# EAGLE design mattduino_leonardo (EAGLE 8.6.3)

## Sheet 1 of 3
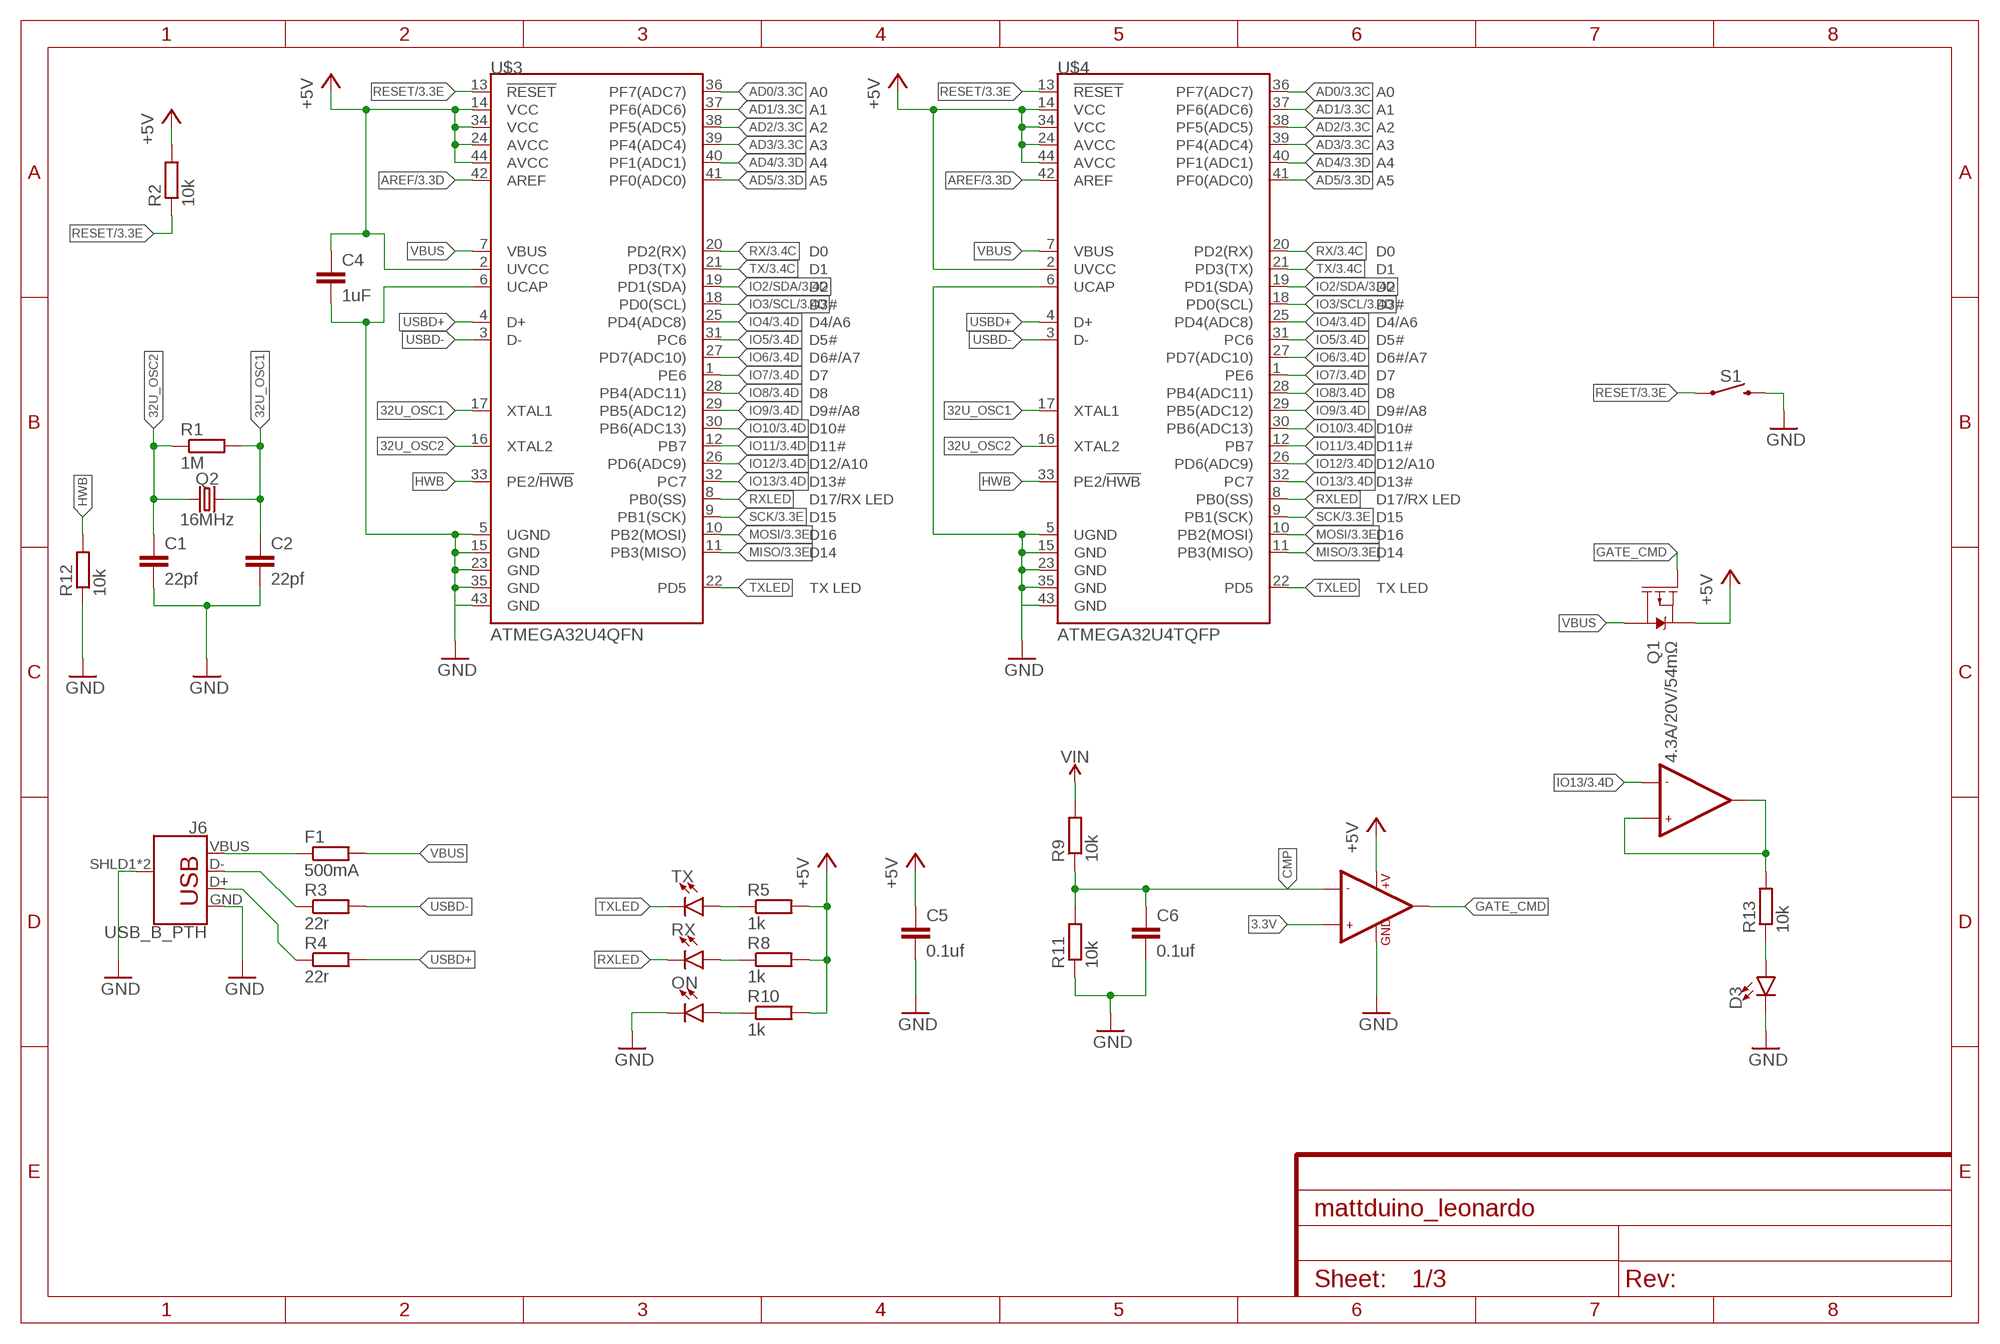
[diagram p0: schematic, sheet 1]

### Parts
C1  22pf  C-EUC1206  [C1206]
C2  22pf  C-EUC1206  [C1206]
C4  1uF  C-EUC1206  [C1206]
C5  0.1uf  C-EUC1206  [C1206]
C6  0.1uf  C-EUC1206  [C1206]
D3  LED1206  [LED-1206]
F1  500mA  R-EU_R1206  [R1206]
J6  USB_B_PTH  [USB-B-PTH]
ON  LED1206  [LED-1206]
Q1  4.3A/20V/54mΩ  MOSFET_PCH-IRLML2244  [SOT23-3]
Q2  16MHz  CRYSTALSMD-HC49UP  [HC49UP]
R1  1M  R-EU_R1206  [R1206]
R2  10k  R-EU_R1206  [R1206]
R3  22r  R-EU_R1206  [R1206]
R4  22r  R-EU_R1206  [R1206]
R5  1k  R-EU_R1206  [R1206]
R8  1k  R-EU_R1206  [R1206]
R9  10k  R-EU_R1206  [R1206]
R10  1k  R-EU_R1206  [R1206]
R11  10k  R-EU_R1206  [R1206]
R12  10k  R-EU_R1206  [R1206]
R13  10k  R-EU_R1206  [R1206]
RX  LED1206  [LED-1206]
S1  MOMENTARY-SWITCH-SPST-PTH-6.0MM-KIT  [TACTILE_SWITCH_PTH_6.0MM_KIT]
TX  LED1206  [LED-1206]
U$1  LMV358  [SO08]
U$3  ATMEGA32U4QFN  [SPARKFUN-DIGITALIC_QFN-44]
U$4  ATMEGA32U4TQFP  [SPARKFUN-DIGITALIC_TQFP44]

### Nets
3.3V: U$1.3(+IN1) ; also sheet 2,3
32U_OSC1: C2.1 Q2.2 R1.2 U$3.17(XTAL1) U$4.17(XTAL1)
32U_OSC2: C1.1 Q2.1 R1.1 U$3.16(XTAL2) U$4.16(XTAL2)
+5V [power usb]: C4.1 C5.1 Q1.2(S) R2.2 R5.2 R8.2 R10.2 U$1.8(+V) U$3.2(UVCC) U$3.14(VCC) U$3.24(AVCC) U$3.34(VCC) U$3.44(AVCC) U$4.2(UVCC) U$4.14(VCC) U$4.24(AVCC) U$4.34(VCC) U$4.44(AVCC) ; also sheet 2,3
AD0: U$3.36(PF7(ADC7)) U$4.36(PF7(ADC7)) ; also sheet 3
AD1: U$3.37(PF6(ADC6)) U$4.37(PF6(ADC6)) ; also sheet 3
AD2: U$3.38(PF5(ADC5)) U$4.38(PF5(ADC5)) ; also sheet 3
AD3: U$3.39(PF4(ADC4)) U$4.39(PF4(ADC4)) ; also sheet 3
AD4: U$3.40(PF1(ADC1)) U$4.40(PF1(ADC1)) ; also sheet 3
AD5: U$3.41(PF0(ADC0)) U$4.41(PF0(ADC0)) ; also sheet 3
AREF: U$3.42(AREF) U$4.42(AREF) ; also sheet 3
CMP: C6.1 R9.1 R11.2 U$1.2(-IN1)
GATE_CMD: Q1.1(G) U$1.1(OUT1)
GND [gnd]: C1.2 C2.2 C4.2 C5.2 C6.2 D3.C J6.GND J6.SHLD1(SHIELD) J6.SHLD2(SHIELD) ON.C R11.1 R12.1 S1.3 U$1.4(GND) U$3.5(UGND) U$3.6(UCAP) U$3.15(GND) U$3.23(GND) U$3.35(GND) U$3.43(GND) U$4.5(UGND) U$4.6(UCAP) U$4.15(GND) U$4.23(GND) U$4.35(GND) U$4.43(GND) ; also sheet 2,3
HWB: R12.2 U$3.33(PE2/!HWB) U$4.33(PE2/!HWB)
IO2/SDA: U$3.19(PD1(SDA)) U$4.19(PD1(SDA)) ; also sheet 3
IO3/SCL: U$3.18(PD0(SCL)) U$4.18(PD0(SCL)) ; also sheet 3
IO4: U$3.25(PD4(ADC8)) U$4.25(PD4(ADC8)) ; also sheet 3
IO5: U$3.31(PC6) U$4.31(PC6) ; also sheet 3
IO6: U$3.27(PD7(ADC10)) U$4.27(PD7(ADC10)) ; also sheet 3
IO7: U$3.1(PE6) U$4.1(PE6) ; also sheet 3
IO8: U$3.28(PB4(ADC11)) U$4.28(PB4(ADC11)) ; also sheet 3
IO9: U$3.29(PB5(ADC12)) U$4.29(PB5(ADC12)) ; also sheet 3
IO10: U$3.30(PB6(ADC13)) U$4.30(PB6(ADC13)) ; also sheet 3
IO11: U$3.12(PB7) U$4.12(PB7) ; also sheet 3
IO12: U$3.26(PD6(ADC9)) U$4.26(PD6(ADC9)) ; also sheet 3
IO13: U$1.6(-IN2) U$3.32(PC7) U$4.32(PC7) ; also sheet 3
MISO: U$3.11(PB3(MISO)) U$4.11(PB3(MISO)) ; also sheet 3
MOSI: U$3.10(PB2(MOSI)) U$4.10(PB2(MOSI)) ; also sheet 3
N$3: R13.2 U$1.5(+IN2) U$1.7(OUT2)
N$4: ON.A R10.1
N$5: D3.A R13.1
N$6: R8.1 RX.A
N$7: R5.1 TX.A
RESET: R2.1 S1.1 U$3.13(!RESET) U$4.13(!RESET) ; also sheet 3
RX: U$3.20(PD2(RX)) U$4.20(PD2(RX)) ; also sheet 3
RXLED: RX.C U$3.8(PB0(SS)) U$4.8(PB0(SS))
SCK: U$3.9(PB1(SCK)) U$4.9(PB1(SCK)) ; also sheet 3
TX: U$3.21(PD3(TX)) U$4.21(PD3(TX)) ; also sheet 3
TXLED: TX.C U$3.22(PD5) U$4.22(PD5)
USBD+: R4.2 U$3.4(D+) U$4.4(D+)
USBD-: R3.2 U$3.3(D-) U$4.3(D-)
USBR+: J6.D+ R4.1
USBR-: J6.D- R3.1
VBUS: F1.2 Q1.3(D) U$3.7(VBUS) U$4.7(VBUS)
VBUS_UNFUSED: F1.1 J6.VBUS
VIN: R9.2 ; also sheet 2,3

## Sheet 2 of 3
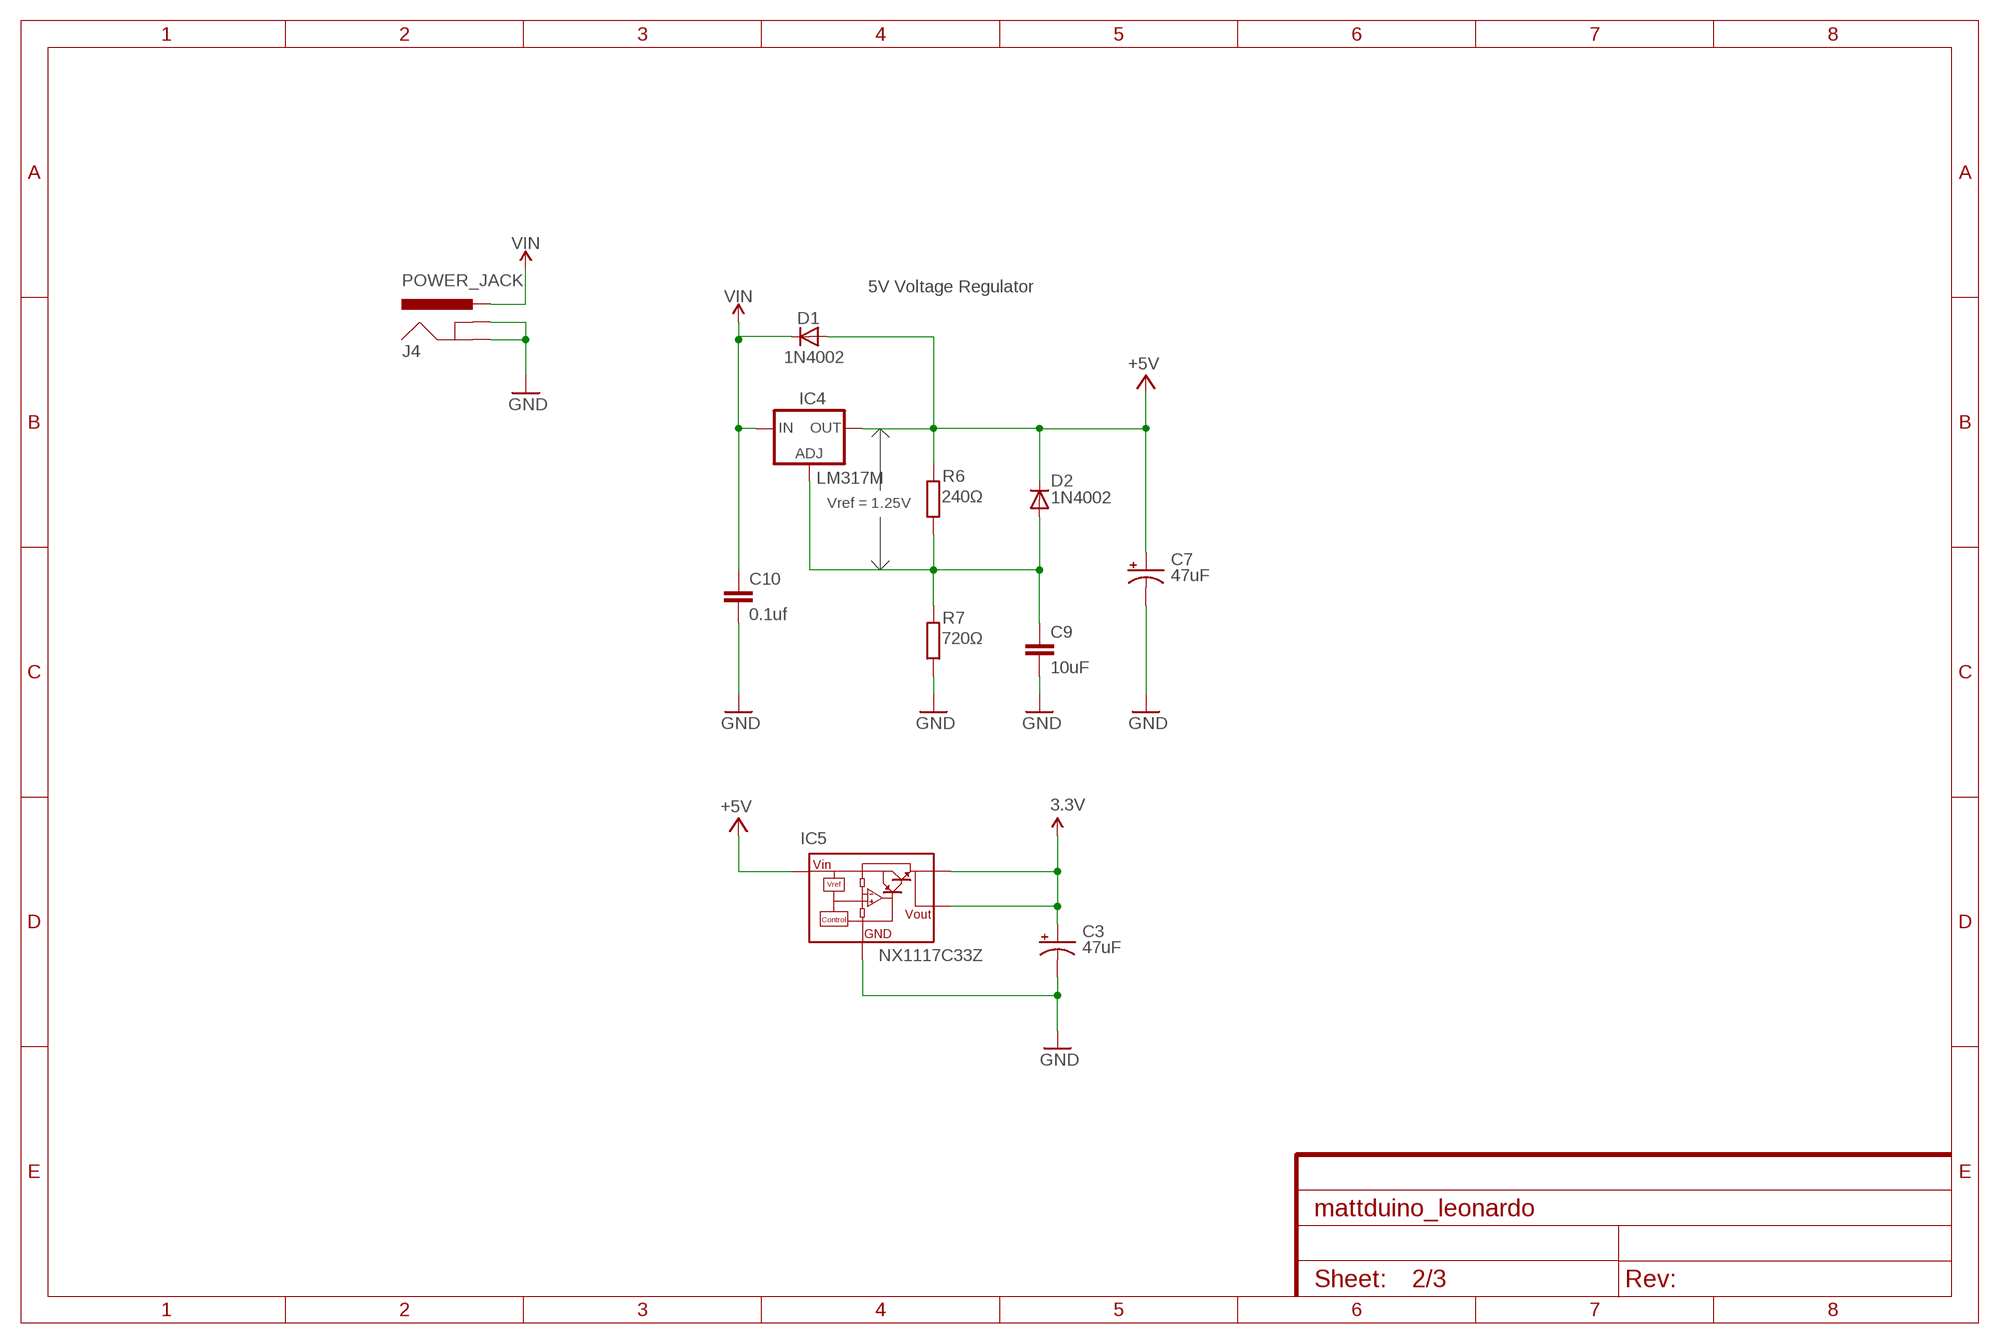
[diagram p1: schematic, sheet 2]

### Parts
C3  47uF  47UF-POLAR-PANASONIC_D-35V-20%  [PANASONIC_D]
C7  47uF  47UF-POLAR-PANASONIC_D-35V-20%  [PANASONIC_D]
C9  10uF  C-EUC1206  [C1206]
C10  0.1uf  C-EUC1206  [C1206]
D1  1N4002  DIODESOD-123  [SOD-123]
D2  1N4002  DIODESOD-123  [SOD-123]
IC4  LM317MBSTT3  [SOT223]
IC5  NX1117C33Z  [SOT223]
J4  POWER_JACK  [POWER_JACK_PTH]
R6  240Ω  R-EU_R1206  [R1206]
R7  720Ω  R-EU_R1206  [R1206]

### Nets
3.3V: C3.+ IC5.2(VOUT1) IC5.4(VOUT) ; also sheet 1,3
+5V [power usb]: C7.+ D1.A D2.C IC4.4(OUT) IC5.3(VIN) R6.2 ; also sheet 1,3
GND [gnd]: C3.- C7.- C9.2 C10.2 IC5.1(GND) J4.GND J4.GNDBREAK R7.1 ; also sheet 1,3
N$1: C9.1 D2.A IC4.1(ADJ) R6.1 R7.2
VIN: C10.1 D1.C IC4.3(IN) J4.PWR ; also sheet 1,3

### Notes on the sheet
- 5V Voltage Regulator
- Vref = 1.25V

## Sheet 3 of 3
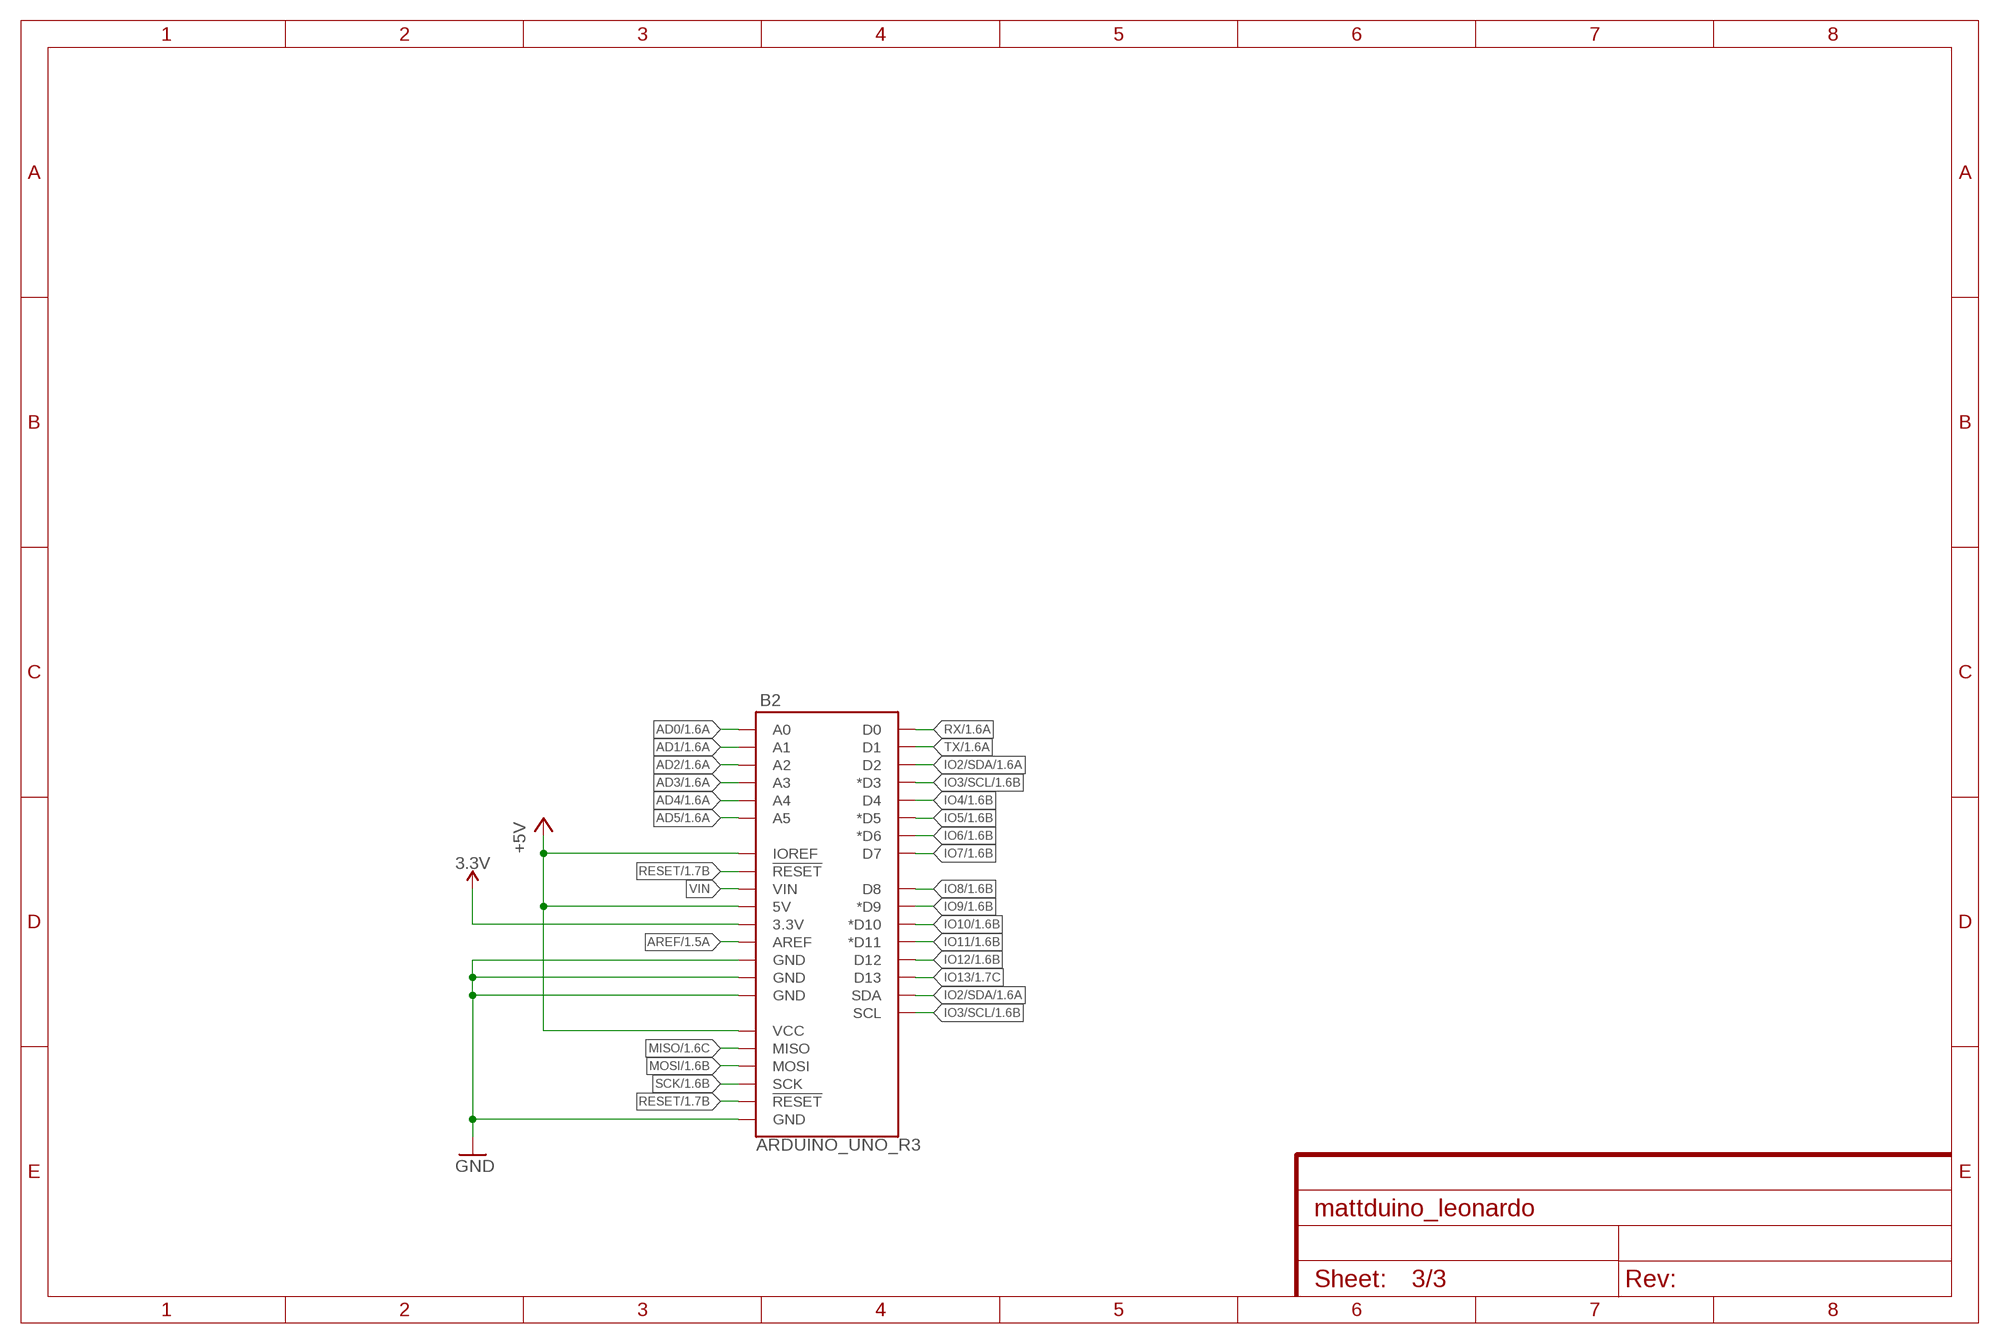
[diagram p2: schematic, sheet 3]

### Parts
B2  ARDUINO_UNO_R3  [ARDUINO_R3]

### Nets
3.3V: B2.3.3V ; also sheet 1,2
+5V [power usb]: B2.5V B2.IOREF B2.VCC ; also sheet 1,2
AD0: B2.A0 ; also sheet 1
AD1: B2.A1 ; also sheet 1
AD2: B2.A2 ; also sheet 1
AD3: B2.A3 ; also sheet 1
AD4: B2.A4 ; also sheet 1
AD5: B2.A5 ; also sheet 1
AREF: B2.AREF ; also sheet 1
GND [gnd]: B2.GND@1(GND) B2.GND@2(GND) B2.GND@3(GND) B2.GND@4(GND) ; also sheet 1,2
IO2/SDA: B2.D2 B2.SDA ; also sheet 1
IO3/SCL: B2.D3(*D3) B2.SCL ; also sheet 1
IO4: B2.D4 ; also sheet 1
IO5: B2.D5(*D5) ; also sheet 1
IO6: B2.D6(*D6) ; also sheet 1
IO7: B2.D7 ; also sheet 1
IO8: B2.D8 ; also sheet 1
IO9: B2.D9(*D9) ; also sheet 1
IO10: B2.D10(*D10) ; also sheet 1
IO11: B2.D11(*D11) ; also sheet 1
IO12: B2.D12 ; also sheet 1
IO13: B2.D13 ; also sheet 1
MISO: B2.MISO ; also sheet 1
MOSI: B2.MOSI ; also sheet 1
RESET: B2.RESET@1(!RESET!) B2.RESET@2(!RESET!) ; also sheet 1
RX: B2.D0 ; also sheet 1
SCK: B2.SCK ; also sheet 1
TX: B2.D1 ; also sheet 1
VIN: B2.VIN ; also sheet 1,2

## Library data of the parts
B2 = SparkFun-Boards:ARDUINO_UNO_R3: Arduino R3 Footprint with SPI header Arduino Uno R3 Compatible Footprint. Matches PCB size of the original board. SparkFun Products: SAMD21 Dev Breakout <https://www.sparkfun.com/products/13672> RedBoard <https://www.sparkfun.com/products/12757> R3 Stackable Headers <https://www.sparkfun.com/products/11417>
C1 C2 C4-C6 C9 C10 = rcl:C-EU: CAPACITOR, European symbol; SPICEPREFIX: C
C3 C7 = SparkFun-Capacitors:47UF-POLAR: 47µF polarized capacitors A capacitor is a passive two-terminal electrical component used to store electrical energy temporarily in an electric field.; PROD_ID: CAP-08478
D1 D2 = adafruit:DIODE: Diode SMADIODE - SMA Surface Mount Package 20V 1A Schottky Diode Digikey: 641-1014-6-ND DO-1N4148 - Through Hole Small Current Diode SOD-123 20V 1 A (.5mV Vf) Schottky Diode - Digikey: MBRX120TPMSCT-ND SOD-323 10V 570mA (.38mV Vf, 3ns) Schottky Diode - Digikey: ZLLS410CT-ND SOD-523 30V 30mA Schottky Diode (RB751S-40TE61) - Digikey: RB751S-40TE61CT-ND SOT23-R/W - SOT23 Package (R = Solder Paste/Reflow Ovens, W = Hand-Soldering) BAT54Film 40V 300mA - Digikey: 497-7162-1-ND
D3 ON RX TX = SparkFun-LED:LED: LED (Generic) Standard schematic elements and footprints for 5mm, 3mm, 1206, and 0603 sized LEDs. Generic LEDs with no color specified.
F1 R1-R13 = rcl:R-EU_: RESISTOR, European symbol; SPICEPREFIX: R
IC4 = v-reg:LM317?*: 500 mA Adjustable Output Positive Voltage Regulator Source: http://www.onsemi.co.jp .. LM317M-D.PDF; PARTNUMBER: LM317M
IC5 = nxp_60:NX1117C: The NX1117C/NX1117CE are two series of low-dropout positive voltage regulators with an output current capability of 1 A. AAL Eindhoven MK; 12NC: 9352 914 42115; TOLERANCE: 1.25%; VOLTAGE: 5.0V
J4 = SparkFun-Connectors:POWER_JACK: Power Jack Connector This is the standard 5.5mm barrel jack for power. The PTH is the most common, proven, reliable, footprint. The Slot footprint only works if the mill layer is transmitted to the PCB fab house so be warned. Here are the connectors we sell at SparkFun: DC Barrel Power Jack/Connector <https://www.sparkfun.com/products/119> (PRT-00119) DC Barrel Power Jack/Connector (SMD) <https://www.sparkfun.com/products/12748> (PRT-12748) DC Barrel Jack Adapter - Breadboard Compatible <https://www.sparkfun.com/products/10811> (PRT-10811) It is used on this SparkFun product (and many, many others): SparkFun RedBoard - Programmed with Arduino <https://www.sparkfun.com/products/12757> (DEV-12757) Also, if you need a mating power supply or connector, please check these out: Wall Adapter Power Supply - 9VDC 650mA <https://www.sparkfun.com/products/298> (TOL-00298) DC Barrel Jack Adapter - Male <https://www.sparkfun.com/products/10287> (PRT-10287); PROD_ID: CONN-08197
J6 = SparkFun-Connectors:USB_B: USB Type B Connector SparkFun Products: SparkFun Stepoko <https://www.sparkfun.com/products/13899> PTH; PROD_ID: CONN-08278; SF_ID: PRT-00139
Q1 = SparkFun-DiscreteSemi:MOSFET_PCH: P-channel MOSFETs Voltage controlled devices that allow control of high current outputs. SparkFun Products: SparkFun ESP32 Thing <https://www.sparkfun.com/products/13907> SparkFun ESP8266 Thing <https://www.sparkfun.com/products/13231>; PROD_ID: TRANS-11153
Q2 = SparkFun-Clocks:CRYSTAL: Crystals (Generic) These are passive quartz crystals, which can be used as a clock source for a microcontroller. Crystal's are two-terminal devices. They require external "load" capacitors to generate an oscillating signal.
S1 = SparkFun-Switches:MOMENTARY-SWITCH-SPST: Momentary Switch (Pushbutton) - SPST Normally-open (NO) SPST momentary switches (buttons, pushbuttons). Variants PTH-12MM - 12mm square, through-hole Momentary Pushbutton Switch - 12mm Square <https://www.sparkfun.com/products/9190> (COM-09190) PTH-6.0MM, PTH-6.0MM-KIT - 6.0mm square, through-hole Mini Pushbutton Switch <https://www.sparkfun.com/products/97> (COM-00097) KIT package intended for soldering kit's - only one side of pads' copper is exposed. PTH-RIGHT-ANGLE-KIT - Right-angle, through-hole Right Angle Tactile Button <https://www.sparkfun.com/products/10791> - Used on SparkFun BigTime Watch Kit <https://www.sparkfun.com/products/11734> SMD-12MM - 12mm square, surface-mount Tactile Button - SMD (12mm) <https://www.sparkfun.com/products/12993> (COM-12993) Used on SparkFun PicoBoard <https://www.sparkfun.com/products/11888> SMD-4.5MM - 4.5mm Square Trackball Switch Used on SparkFun Blackberry Trackballer Breakout <https://www.sparkfun.com/products/13169> SMD-4.6MMX2.8MM - 4.60mm x 2.80mm, surface mount Used on SparkFun SAMD21 Mini Breakout <https://www.sparkfun.com/products/13664> SMD-5.2MM, SMD-5.2-REDUNDANT - 5.2mm square, surface-mount Mini Pushbutton Switch - SMD <https://www.sparkfun.com/products/8720> (COM-08720) Used on Arduino Pro Mini <https://www.sparkfun.com/products/11114> REDUNDANT package connects both switch circuits together SMD-6.0X3.5MM - 6.0 x 3.5mm, surface mount Momentary Reset Switch SMD <https://www.sparkfun.com/products/8229> (COM-08229) SMD-6.2MM-TALL - 6.2mm square, surface mount Tactile Button - SMD (6mm) <https://www.sparkfun.com/products/12992> Used on SparkFun Digital Sandbox <https://www.sparkfun.com/products/12651> SMD-RIGHT-ANGLE - Right-angle, surface mount Used on SparkFun Block for Intel® Edison - Arduino <https://www.sparkfun.com/products/13036>; PROD_ID: SWCH-08441; SF_SKU: COM-00097
U$1 = SparkFun:LMV358
U$3 = SparkFun-Retired:ATMEGA32U4: Atmel 44-pin 8-bit Microcontroller with 32KBytes of ISP Flash and USB Controller ----- Please use the QFN-44-NOPAD_1:1 package for the footprint of all boards using a 32U4. Route traces directly away from the pads as much as possible.
U$4 = SparkFun-Retired:ATMEGA32U4: Atmel 44-pin 8-bit Microcontroller with 32KBytes of ISP Flash and USB Controller ----- Please use the QFN-44-NOPAD_1:1 package for the footprint of all boards using a 32U4. Route traces directly away from the pads as much as possible.; PROD_ID: IC-11161

## Net classes
2 gnd: width 0.305 mm, drill 0.406 mm, clearance 0.203 mm
3 power usb: width 0.508 mm, drill 0.406 mm, clearance 0.203 mm

## Board
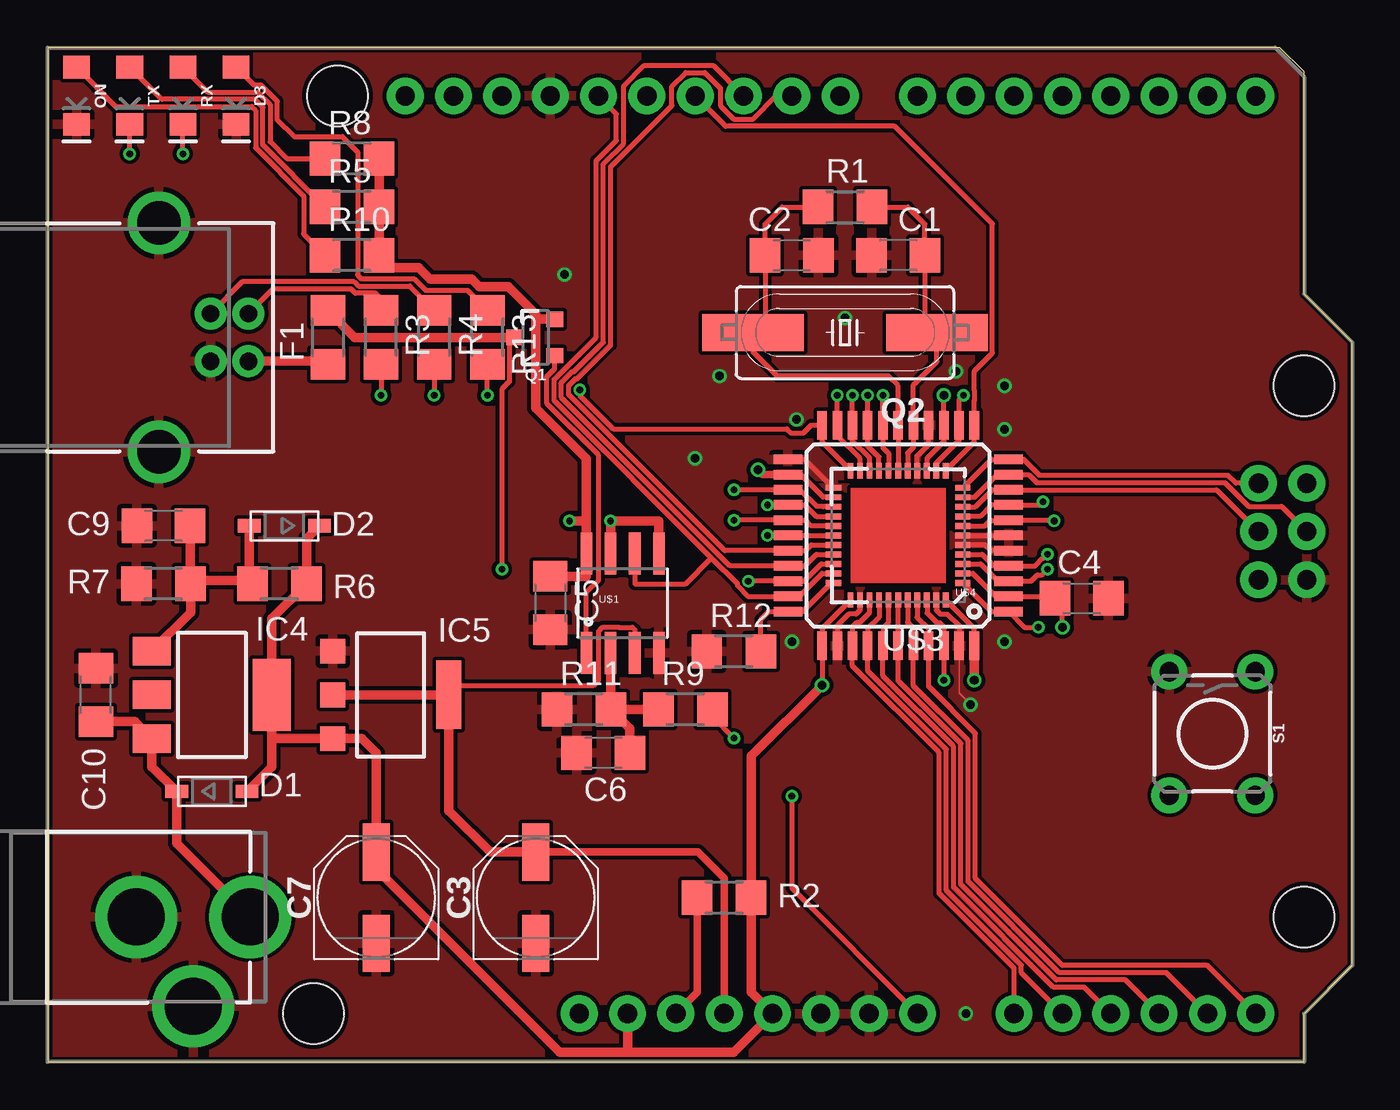
[diagram p3: board, top side]
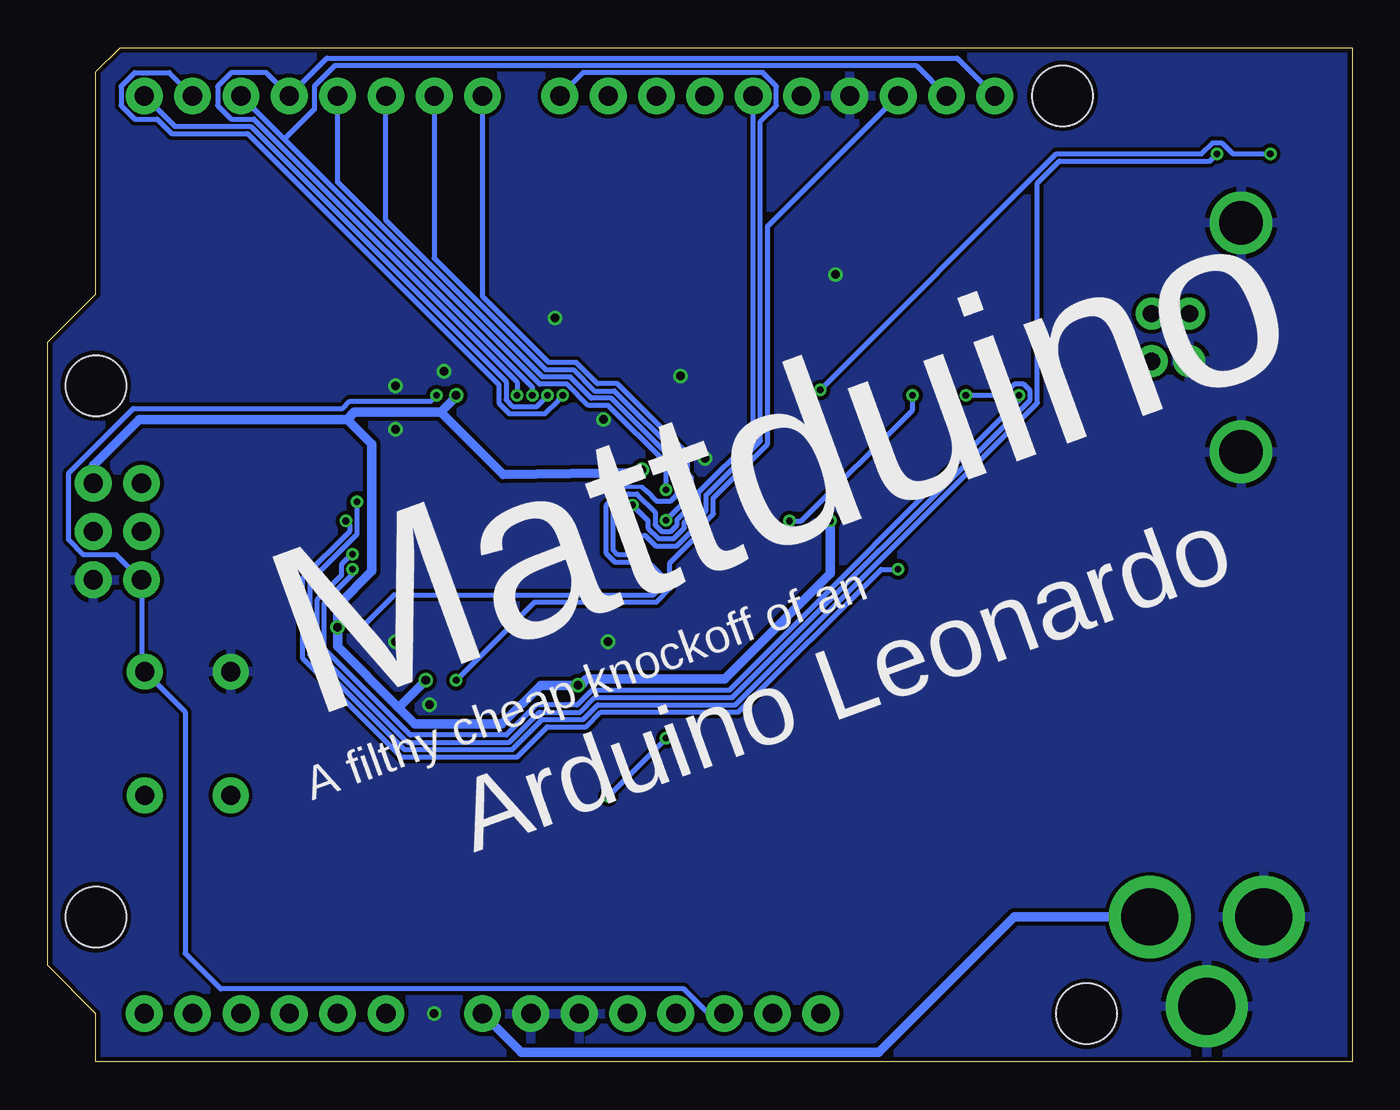
[diagram p4: board, bottom side, seen from below]

Size 68.58 x 53.34 mm. Coordinates in mm from the lower left corner, seen from the top.
Outline: 0,0 66.04,0 66.04,2.54 68.58,5.08 68.58,37.85 66.04,40.39 66.04,52.07 64.77,53.34 0,53.34 0,0
Copper layers (1*16): Top 0.035mm / dielectric 1.5mm / Bottom 0.035mm
Design rules "dirtypcbs": minimum track width 5mil, minimum drill 12mil, track to track 5mil, track to pad 5mil, pad to pad 5mil, via to via 5mil, smd to smd 0mil, copper to edge 10mil, drill to drill 10mil, minimum pad ring 10mil, minimum via ring 6mil, stop-mask expansion 2mil, vias tented up to drill 25mil, thermal gap 10mil

### Footprints (pad centres in the part's own frame; a part is rotated, then mirrored left to right if it is on the bottom)
ARDUINO_R3 = drill 1.016 pad 1.93: 3.3V 2.54,-24.13; 5V 5.08,-24.13; A0 17.78,-24.13; A1 20.32,-24.13; A2 22.86,-24.13; A3 25.4,-24.13; A4 27.94,-24.13; A5 30.48,-24.13; AREF -9.144,24.13; D0 30.48,24.13; D1 27.94,24.13; D2 25.4,24.13; D3 22.86,24.13; D4 20.32,24.13; D5 17.78,24.13; D6 15.24,24.13; D7 12.7,24.13; D8 8.636,24.13; D9 6.096,24.13; D10 3.556,24.13; D11 1.016,24.13; D12 -1.524,24.13; D13 -4.064,24.13; GND@1 7.62,-24.13; GND@2 10.16,-24.13; GND@3 -6.604,24.13; GND@4 33.16,-1.32; IOREF -2.54,-24.13; MISO 30.62,3.76; MOSI 33.16,1.22; NC -5.08,-24.13; RESET@1 0,-24.13; RESET@2 30.62,-1.32; SCK 30.62,1.22; SCL -14.224,24.13; SDA -11.684,24.13; VCC 33.16,3.76; VIN 12.7,-24.13 | hole 3.175: -17.78,24.13; 33.02,8.89; 33.02,-19.05; -19.05,-24.13
C1206 = smd 1.6 x 1.8: 1 -1.4,0; 2 1.4,0
PANASONIC_D = smd 3 x 1.4: + 2.4,0; - -2.4,0
SOD-123 = smd 1.2 x 0.7: A 1.85,0; C -1.85,0
LED-1206 = smd 1.2 x 1.4: A -1.5,0; C 1.5,0
R1206 = smd 1.6 x 1.803: 1 -1.422,0; 2 1.422,0
SOT223 = smd 1.5 x 2: 1 -2.3,-3.15; 2 0,-3.15; 3 2.3,-3.15 | smd 3.8 x 2: 4 0,3.15
SOT223' = smd 1.3 x 1.3: 1 -2.3,-3.05; 2 0,-3.05; 3 2.3,-3.05 | smd 3.6 x 1.3: 4 0,3.05
POWER_JACK_PTH = drill 2.997 pad 4.318: GND 0,7.7; GNDBREAK 4.7,10.7; PWR 0,13.7
USB-B-PTH = drill 0.914 pad 1.676: D+ 4,1.25; D- 5.981,1.25; GND 4,-1.25; VBUS 5.981,-1.25 | drill 2.286: SHLD1 1.282,-6.02; SHLD2 1.282,6.02
SOT23-3 = smd 0.8 x 0.9: 1 -0.95,-1; 2 0.95,-1; 3 0,1.1
HC49UP = smd 5.334 x 1.93: 1 -4.826,0; 2 4.826,0
TACTILE_SWITCH_PTH_6.0MM_KIT = drill 1.016 pad 1.88: 1 -3.251,2.261; 2 3.251,2.261; 3 -3.251,-2.261; 4 3.251,-2.261
SO08 = smd 0.61 x 2.21: 1 -1.905,-2.616; 2 -0.635,-2.616; 3 0.635,-2.616; 4 1.905,-2.616; 5 1.905,2.616; 6 0.635,2.616; 7 -0.635,2.616; 8 -1.905,2.616
SPARKFUN-DIGITALIC_QFN-44 = smd 0.8 x 0.3: 1 -3.4,2.5; 2 -3.4,2; 3 -3.4,1.5; 4 -3.4,1; 5 -3.4,0.5; 6 -3.4,0; 7 -3.4,-0.5; 8 -3.4,-1; 9 -3.4,-1.5; 10 -3.4,-2; 11 -3.4,-2.5; 23 3.4,-2.5; 24 3.4,-2; 25 3.4,-1.5; 26 3.4,-1; 27 3.4,-0.5; 28 3.4,0; 29 3.4,0.5; 30 3.4,1; 31 3.4,1.5; 32 3.4,2; 33 3.4,2.5 | smd 0.3 x 0.8: 12 -2.5,-3.4; 13 -2,-3.4; 14 -1.5,-3.4; 15 -1,-3.4; 16 -0.5,-3.4; 17 0,-3.4; 18 0.5,-3.4; 19 1,-3.4; 20 1.5,-3.4; 21 2,-3.4; 22 2.5,-3.4; 34 2.5,3.4; 35 2,3.4; 36 1.5,3.4; 37 1,3.4; 38 0.5,3.4; 39 0,3.4; 40 -0.5,3.4; 41 -1,3.4; 42 -1.5,3.4; 43 -2,3.4; 44 -2.5,3.4
SPARKFUN-DIGITALIC_TQFP44 = smd 1.5 x 0.5: 1 -5.8,4; 2 -5.8,3.2; 3 -5.8,2.4; 4 -5.8,1.6; 5 -5.8,0.8; 6 -5.8,0; 7 -5.8,-0.8; 8 -5.8,-1.6; 9 -5.8,-2.4; 10 -5.8,-3.2; 11 -5.8,-4; 23 5.8,-4; 24 5.8,-3.2; 25 5.8,-2.4; 26 5.8,-1.6; 27 5.8,-0.8; 28 5.8,0; 29 5.8,0.8; 30 5.8,1.6; 31 5.8,2.4; 32 5.8,3.2; 33 5.8,4 | smd 0.5 x 1.5: 12 -4,-5.8; 13 -3.2,-5.8; 14 -2.4,-5.8; 15 -1.6,-5.8; 16 -0.8,-5.8; 17 0,-5.8; 18 0.8,-5.8; 19 1.6,-5.8; 20 2.4,-5.8; 21 3.2,-5.8; 22 4,-5.8; 34 4,5.8; 35 3.2,5.8; 36 2.4,5.8; 37 1.6,5.8; 38 0.8,5.8; 39 0,5.8; 40 -0.8,5.8; 41 -1.6,5.8; 42 -2.4,5.8; 43 -3.2,5.8; 44 -4,5.8

### Placement (x,y rotation side)
B2  33.02,26.67 0 top
C1  44.7,42.42 180 top
C2  39.12,42.42 0 top
C3  25.65,8.64 90 top
C4  54.36,24.38 0 top
C5  26.42,24.13 270 top
C6  29.21,16.26 180 top
C7  17.27,8.64 90 top
C9  6.1,28.19 180 top
C10  2.54,19.3 90 top
D1  8.64,14.22 0 top
D2  12.45,28.19 180 top
D3  9.91,50.8 270 top
F1  14.73,38.1 90 top
IC4  8.64,19.3 270 top
IC5  NX1117C33Z  [SOT223']  18.03,19.3 270 top
J4  -3.05,7.62 270 top
J6  4.57,38.1 0 top
ON  1.52,50.8 270 top
Q1  25.65,38.1 90 top
Q2  41.91,38.35 180 top
R1  41.91,44.96 180 top
R2  35.56,8.64 0 top
R3  17.53,38.1 270 top
R4  20.32,38.1 270 top
R5  16,44.96 0 top
R6  12.19,25.15 0 top
R7  6.1,25.15 0 top
R8  16,47.5 0 top
R9  33.53,18.54 0 top
R10  16,42.42 0 top
R11  28.19,18.54 0 top
R12  36.07,21.59 0 top
R13  23.11,38.1 270 top
RX  7.11,50.8 270 top
S1  61.21,17.27 270 top
TX  4.32,50.8 270 top
U$1  30.23,24.13 0 top
U$3  44.7,27.69 180 top
U$4  44.7,27.69 180 top

### Tracks (layer width: path | path; a pad name or v marks a point on that pad's centre or on a via)
3.3V
  Top 0.254: IC5.4 21.59,19.81 28.7,19.81 28.96,20.07 28.96,22.65 29.18,22.87 30,22.87 30.01,22.86 30.73,22.86 30.86,22.73 U$1.3
  Top 0.406: B2.3.3V 35.56,9.65 34.18,11.04 C3.+
  Top 0.508: IC5.2 IC5.4 21.08,13.21 23.25,11.04 C3.+
32U_OSC1
  Top 0.254: U$3.17 U$4.17 44.7,35.56 44.2,36.07 38.35,36.07 37.08,37.34 Q2.2 37.72,38.99 C2.1 37.72,44.07 38.61,44.96 R1.2
32U_OSC2
  Top 0.254: U$3.16 45.2,32.02 45.5,32.32 U$4.16 45.5,35.6 46.74,36.83 Q2.1 46.1,38.99 C1.1 46.1,44.07 45.21,44.96 R1.1
+5V  (via drill 0.35, 0.45)
  Top 0.254: U$3.2 48.64,25.69 49.84,24.49 U$4.2 52.85,24.49 C4.1 53.34,24 v53.34,22.86 | U$3.14 46.22,31.11 46.22,31.62 46.23,31.63 46.23,31.75 47.1,32.63 U$4.14 v47.1,35.05 | U$3.44 48.7,22.79 U$4.44 | U$3.34 40.7,22.79 U$4.34 v40.7,19.81 | U$3.24 41.15,29.69 41.13,29.71 40.77,29.71 39.59,30.89 U$4.24
  Top 0.406: U$4.24 37.59,30.89 v37.34,31.14
  Top 0.508: 11.79,17.02 IC4.4 11.79,23.32 R6.2 13.61,27.51 D2.C | 11.79,17.02 11.79,15.52 D1.A | 11.79,17.02 11.8,17 IC5.3 16.5,17 16.51,17.02 17.27,16.26 C7.+ 17.27,10.16 26.92,0.51 30.48,0.51 | 30.48,0.51 36.07,0.51 B2.5V 36.98,3.66 R2.2 36.98,16.09 v40.7,19.81 | B2.IOREF 30.48,0.51 | C5.1 28.32,25.53 U$1.8 28.32,28.45 | 25.66,39.12 25.66,34.38 28.32,31.72 28.32,28.45 | 25.66,39.12 25.66,39.32 24.2,40.78 22.68,40.78 22.3,41.16 20.12,41.16 19.51,41.77 18.07,41.77 R10.2 R5.2 R8.2 | v27.43,28.45 28.32,28.45 | Q1.2 25.73,39.05 25.66,39.12 | U$4.44 v48.7,20.07
  Bottom 0.508: B2.VCC 66.18,31.36 63.75,33.78 52.83,33.78 | 52.83,33.78 52.45,34.16 47.92,34.16 | v37.34,31.14 37.44,31.14 37.59,30.99 44.64,30.89 47.92,34.16 | v47.1,35.05 47.1,34.98 47.92,34.16 | 50.16,18.67 49.28,17.78 44.7,17.78 42.67,19.81 v40.7,19.81 40.55,19.81 40.24,20.13 32.99,20.13 27.43,25.69 v27.43,28.45 | 50.16,18.67 53.34,21.84 v53.34,22.86 53.34,24.01 51.54,25.81 51.54,32.49 52.83,33.78 | v48.7,20.07 50.1,18.67 50.16,18.67
AD0
  Top 0.254: U$3.36 43.18,24.27 43.18,23.6 42.68,23.1 42.53,23.1 42.3,22.87 U$4.36 42.3,20.83 46.86,16.27 46.86,8.86 50.8,4.93 B2.A0
AD1
  Top 0.254: U$3.37 43.7,23.38 43.1,22.78 U$4.37 43.1,20.57 47.24,16.43 47.24,9.02 51.18,5.08 51.18,4.7 B2.A1
AD2
  Top 0.254: U$3.38 44.2,23.12 43.94,22.86 43.94,21.92 U$4.38 43.9,20.31 47.62,16.59 47.62,9.18 52.87,3.94 54.48,3.94 B2.A2
AD3
  Top 0.254: U$3.39 U$4.39 44.7,20.04 48.01,16.74 48.01,9.34 53.02,4.32 56.64,4.32 B2.A3
AD4
  Top 0.254: U$3.40 45.2,23.12 45.47,22.86 45.47,21.92 U$4.40 45.5,19.78 48.39,16.9 48.39,9.49 53.18,4.7 58.8,4.7 B2.A4
AD5
  Top 0.254: U$3.41 45.7,23.38 46.3,22.78 U$4.41 46.3,19.74 48.77,17.27 48.77,9.65 53.34,5.08 60.96,5.08 B2.A5
AREF  (via drill 0.35)
  Top 0.254: U$3.42 46.22,24.27 46.22,23.6 46.73,23.1 46.87,23.1 47.1,22.87 U$4.42 v47.1,20.07
  Bottom 0.254: v47.1,20.07 42.99,24.18 36.57,24.18 35.87,24.89 35.87,26.25 34.29,27.82 34.29,28.11 33.58,28.82 33.58,29.66 30.73,32.5 30.73,43.94 B2.AREF
CMP
  Top 0.508: U$1.2 29.59,18.57 R11.2 | R9.1 R11.2 | C6.1 30.61,17.55 R11.2
GATE_CMD
  Top 0.254: U$1.1 28.32,24.7 28.96,25.34 28.96,31.91 26.25,34.62 26.25,36.05 26.65,36.46 Q1.1
GND  (via drill 0.45)
  Top 0.076: U$4.43 47.9,19.41 v48.51,18.8
  Top 0.254: U$3.23 39.8,31.69 U$4.23 | U$3.6 U$4.6 | U$4.5 49.57,26.89 49.27,27.19 U$3.5 | U$3.43 46.72,24.27 46.72,23.75 46.92,23.56 47.29,23.56 47.9,22.94 U$4.43 | U$3.35 42.68,24.27 42.68,23.75 42.49,23.56 42.12,23.56 41.5,22.94 U$4.35 | U$3.15 45.7,31.87 46.3,32.47 U$4.15
  other vias: 47.75,36.32 41.91,39.12 35.31,36.07 48.26,2.54 39.12,22.1 50.29,33.27 39.37,33.78 50.29,22.1 50.29,35.56 27.18,41.4 34.04,31.75
  pour Top: 0,0 68.58,0 68.58,53.34 0,53.34
  pour Bottom: 0,0 68.58,0 68.58,53.34 0,53.34
HWB
  Top 0.254: U$3.33 41.19,25.19 39.69,23.69 U$4.33 37.91,23.69 37.49,23.27 R12.2
IO2/SDA  (via drill 0.35)
  Top 0.254: U$3.19 43.69,31.1 43.69,31.81 43.1,32.4 U$4.19 v43.1,35.05
  Bottom 0.254: B2.D2 56.13,48.51 | 56.13,48.51 43.1,35.48 v43.1,35.05 | 56.13,48.51 54.56,50.09 54.56,51.3 53.46,52.4 33.78,52.4 22.94,52.4 B2.SDA
IO3/SCL  (via drill 0.35)
  Top 0.254: U$3.18 44.2,32 43.9,32.3 U$4.18 v43.9,35.05
  Bottom 0.254: v43.9,35.05 43.9,35.74 57.74,49.58 58.92,49.58 59.64,50.3 59.64,51.3 58.92,52.02 57.1,52.02 B2.D3 53.9,52.78 20.78,52.78 B2.SCL
IO4  (via drill 0.35)
  Top 0.254: v36.07,30.09 U$4.25 39.54,30.09 40.42,29.21 40.76,29.21 40.77,29.21 41.28,29.21 U$3.25
  Bottom 0.254: B2.D4 53.34,46.26 42.72,35.63 41.26,35.63 40.15,34.52 39.11,34.52 36.07,31.48 v36.07,30.09
IO5  (via drill 0.35)
  Top 0.254: U$3.31 40.66,26.19 39.76,25.29 U$4.31 v36.83,25.29
  Bottom 0.203: 38.24,30.25 37.36,30.25 37.34,30.23
  Bottom 0.254: B2.D5 50.8,44.26 42.56,36.01 41.1,36.01 39.99,34.9 38.95,34.9 35.69,31.64 35.69,30.6 35.49,30.4 35.49,29.84 35.83,29.5 36.59,29.5 37.07,29.98 37.32,30.23 37.34,30.23 | v36.83,25.29 36.83,25.57 37.55,26.29 38.77,26.29 39.24,26.77 39.24,29.25 38.24,30.25
IO6  (via drill 0.35)
  Top 0.254: U$3.27 40.14,28.19 39.84,28.49 U$4.27 v36.07,28.49
  Bottom 0.254: B2.D6 48.26,42.26 42.4,36.4 40.95,36.4 39.84,35.28 38.8,35.28 35.31,31.8 35.31,30.75 35.11,30.55 35.11,29.45 v36.07,28.49
IO7  (via drill 0.35)
  Top 0.254: U$3.1 49.6,23.69 U$4.1 51.33,22.86 v52.07,22.86
  Bottom 0.254: B2.D7 45.72,40.26 42.24,36.78 40.79,36.78 39.68,35.67 38.64,35.67 34.92,31.95 34.92,30.91 34.73,30.71 34.73,29.29 35.49,28.53 35.49,28.25 35.83,27.91 36.31,27.91 36.65,28.25 36.65,28.91 37.6,29.87 38.09,29.87 38.86,29.09 38.86,26.92 38.61,26.67 37.39,26.67 36.25,25.53 36.25,25.05 36.73,24.57 50.37,24.57 v52.07,22.86
IO8  (via drill 0.35)
  Top 0.254: U$3.28 U$4.28 v37.85,27.69
  Bottom 0.254: v37.85,27.69 37.17,27.69 36.62,27.14 35.51,27.14 34.73,27.93 34.73,28.21 33.96,28.98 33.96,29.81 31.11,32.66 31.11,49.46 30.28,50.3 30.28,51.3 30.99,52.02 40.44,52.02 B2.D8
IO9
  Top 0.254: U$3.29 40.14,27.19 39.84,26.89 U$4.29 35.6,26.89 27.39,35.09 27.39,35.58 27.73,35.92 27.82,35.92 29.59,37.69 29.59,47.07 32.82,50.3 32.82,51.3 33.53,52.02 34.54,52.02 35.36,51.2 35.36,50.3 36.07,49.58 37.08,49.58 38.3,50.8 B2.D9
IO10
  Top 0.254: U$3.30 40.4,26.69 39.8,26.09 U$4.30 35.86,26.09 27.01,34.94 27.01,35.73 27.57,36.3 27.66,36.3 29.21,37.85 29.21,47.23 30.28,48.29 30.28,51.3 31.37,52.4 34.98,52.4 B2.D10
IO11
  Top 0.254: U$3.12 48.7,32.59 U$4.12 48.7,34.8 48.72,34.81 48.72,35.29 48.7,35.31 48.7,36.33 49.66,37.28 49.66,44.07 44.53,49.2 35.64,49.2 B2.D11
IO12  (via drill 0.35)
  Top 0.254: U$3.26 40.4,28.69 39.8,29.29 U$4.26 v37.85,29.29
  Bottom 0.254: v37.85,29.29 37.03,28.47 37.03,28.09 36.47,27.52 35.67,27.52 35.11,28.09 35.11,28.37 34.34,29.13 34.34,29.97 31.5,32.82 B2.D12
IO13
  Top 0.254: U$3.32 40.7,25.69 39.5,24.49 U$4.32 36.81,24.49 36.25,25.05 36.25,25.16 34.89,26.51 | B2.D13 29.9,49.86 29.9,48.45 28.83,47.38 28.83,38.09 26.63,35.89 26.63,34.78 34.89,26.51 | U$1.6 30.86,25.15 33.53,25.15 34.89,26.51
MISO
  Top 0.254: U$3.11 49.6,31.69 U$4.11 51.31,31.69 52.15,30.85 62.04,30.85 62.45,30.43 B2.MISO
MOSI
  Top 0.254: U$3.10 48.7,29.69 49.91,30.89 U$4.10 51.56,30.89 51.98,30.47 61.88,30.47 63.13,29.21 64.86,29.21 B2.MOSI
N$1
  Top 0.508: D2.A 10.6,25.32 | 10.6,25.32 R6.1 | C9.1 7.5,25.17 R7.2 | IC4.1 7.52,23.64 R7.2 | R7.2 7.69,25.32 10.6,25.32
N$3  (via drill 0.35)
  Top 0.254: 29.59,28.19 v29.59,28.45 | v23.11,35.05 R13.2
  Top 0.508: U$1.7 29.59,28.19 | U$1.5 32.13,28.45 v29.59,28.45
  Bottom 0.254: v29.59,28.45 28.96,28.45 23.11,34.29 v23.11,35.05
N$4
  Top 0.254: R10.1 13.46,43.54 13.46,45.54 10.94,48.06 10.94,50.04 10.74,50.23 3.59,50.23 ON.A
N$5
  Top 0.254: D3.A 10.83,51.37 11.22,51.37 12.08,50.51 12.08,49.53 12.96,48.65 15.49,48.65 16.29,47.84 16.29,41.38 16.49,41.19 19.27,41.19 19.88,40.58 22.06,40.58 R13.1
N$6
  Top 0.254: R8.1 12.58,47.5 11.7,48.38 11.7,50.35 11.06,50.99 8.42,50.99 RX.A
N$7
  Top 0.254: R5.1 11.32,48.22 11.32,50.2 10.9,50.61 6.01,50.61 TX.A
RESET  (via drill 0.35)
  Top 0.254: U$3.13 46.7,31.5 47.9,32.7 U$4.13 47.9,34.82 v48.14,35.05
  Top 0.406: B2.RESET@1 34.14,3.66 R2.1
  Bottom 0.254: B2.RESET@1 33.84,2.54 35.13,3.83 59.47,3.83 61.35,5.71 61.35,18.39 S1.1 63.64,20.69 B2.RESET@2 64.96,26.67 66.68,26.67 67.47,27.46 67.47,30.97 64.08,34.37 53.07,34.37 52.69,34.75 48.44,34.75 v48.14,35.05
RX  (via drill 0.35)
  Top 0.254: U$3.20 43.2,31.76 42.3,32.66 U$4.20 v42.3,35.05
  Bottom 0.254: B2.D0 61.9,49.2 57.91,49.2 44.48,35.77 44.48,34.81 44.15,34.47 42.86,34.47 42.52,34.81 42.52,34.83 v42.3,35.05
RXLED  (via drill 0.35)
  Top 0.254: U$3.8 49.01,28.69 49.61,29.29 U$4.8 52.15,29.29 v52.32,29.46 | v7.11,47.75 RX.C
  Bottom 0.254: v52.32,29.46 52.32,27.74 54.81,25.26 54.81,21.41 49.83,16.43 44.15,16.43 42.58,18 40.44,18 39.66,18.78 32.44,18.78 16.56,34.65 16.56,46.2 15.4,47.37 7.49,47.37 v7.11,47.75
SCK
  Top 0.254: U$3.9 48.74,29.19 49.64,30.09 U$4.9 61.44,30.09 B2.SCK
TX  (via drill 0.35)
  Top 0.254: U$3.21 42.7,31.72 41.5,32.92 U$4.21 v41.5,35.05
  Bottom 0.254: v41.5,35.05 41.72,34.83 41.72,34.81 42.44,34.09 44.3,34.09 44.87,34.65 44.87,35.62 58.07,48.82 62.06,48.82 62.82,49.58 64,49.58 64.72,50.3 64.72,51.3 64,52.02 62.18,52.02 B2.D1
TXLED  (via drill 0.35)
  Top 0.254: U$3.22 40.7,32.59 U$4.22 40.13,33.49 39.72,33.07 39.08,33.07 38.86,33.29 29.73,33.29 27.95,35.07 27.97,35.08 v27.97,35.34 | v4.32,47.75 TX.C
  Bottom 0.254: v27.97,35.34 15.55,47.75 7.93,47.75 7.35,48.33 6.87,48.33 6.29,47.75 v4.32,47.75
USBD+  (via drill 0.35)
  Top 0.254: U$3.4 49.12,26.69 49.72,26.09 U$4.4 51.91,26.09 52.31,26.49 52.35,26.49 v52.55,26.69 | R4.2 v20.32,35.05
  Bottom 0.254: v52.55,26.69 52.76,26.49 52.8,26.49 53.14,26.15 53.14,25.58 54.43,24.29 54.43,21.57 49.68,16.82 44.3,16.82 42.74,18.38 40.59,18.38 39.81,19.16 32.59,19.16 16.95,34.81 16.95,35.29 17.29,35.63 17.77,35.63 18.35,35.05 v20.32,35.05
USBD-  (via drill 0.35)
  Top 0.254: U$3.3 49.05,26.19 49.95,25.29 U$4.3 51.69,25.29 52.02,25.61 52.26,25.61 v52.55,25.91 | R3.2 v17.53,35.05
  Bottom 0.254: v52.55,25.91 52.55,25.62 54.05,24.13 54.05,21.73 49.52,17.2 44.46,17.2 42.89,18.76 40.75,18.76 39.97,19.54 32.75,19.54 17.53,34.77 v17.53,35.05
USBR+
  Top 0.254: J6.D+ 10.24,41.02 16.11,41.02 16.33,40.8 19.04,40.8 R4.1
USBR-
  Top 0.254: J6.D- 11.84,40.64 15.96,40.64 16.17,40.42 17.23,40.42 17.53,40.13 R3.1
VBUS  (via drill 0.35)
  Top 0.254: U$3.7 49.27,28.19 49.53,28.45 50.47,28.45 U$4.7 52.87,28.49 v52.91,28.45 | Q1.3 24.27,37.82 24.27,35.77 23.88,35.38 v23.88,25.91
  Top 0.508: F1.2 16.15,38.1 Q1.3
  Bottom 0.254: v52.91,28.45 52.7,28.25 52.7,27.9 55.19,25.42 55.19,21.25 49.99,16.05 43.89,16.05 42.32,17.62 40.28,17.62 39.5,18.4 32.28,18.4 24.77,25.91 v23.88,25.91
VBUS_UNFUSED
  Top 0.508: J6.VBUS 14.56,36.85 F1.1
VIN  (via drill 0.35)
  Top 0.254: R9.2 34.95,18.14 v36.07,17.02 | v39.12,13.97 39.12,9.14 B2.VIN
  Top 0.508: J4.PWR 6.79,11.49 D1.C 5.49,15.52 IC4.3 4.59,17.9 C10.1
  Bottom 0.254: v36.07,17.02 v39.12,13.97
  Bottom 0.508: B2.VIN 43.69,0.51 24.89,0.51 17.78,7.62 J4.PWR

### Text on the board
bPlace: Mattduino | A filthy cheap knockoff of an | Arduino Leonardo